# Altium project CUBE_SENSOR.PrjPcb
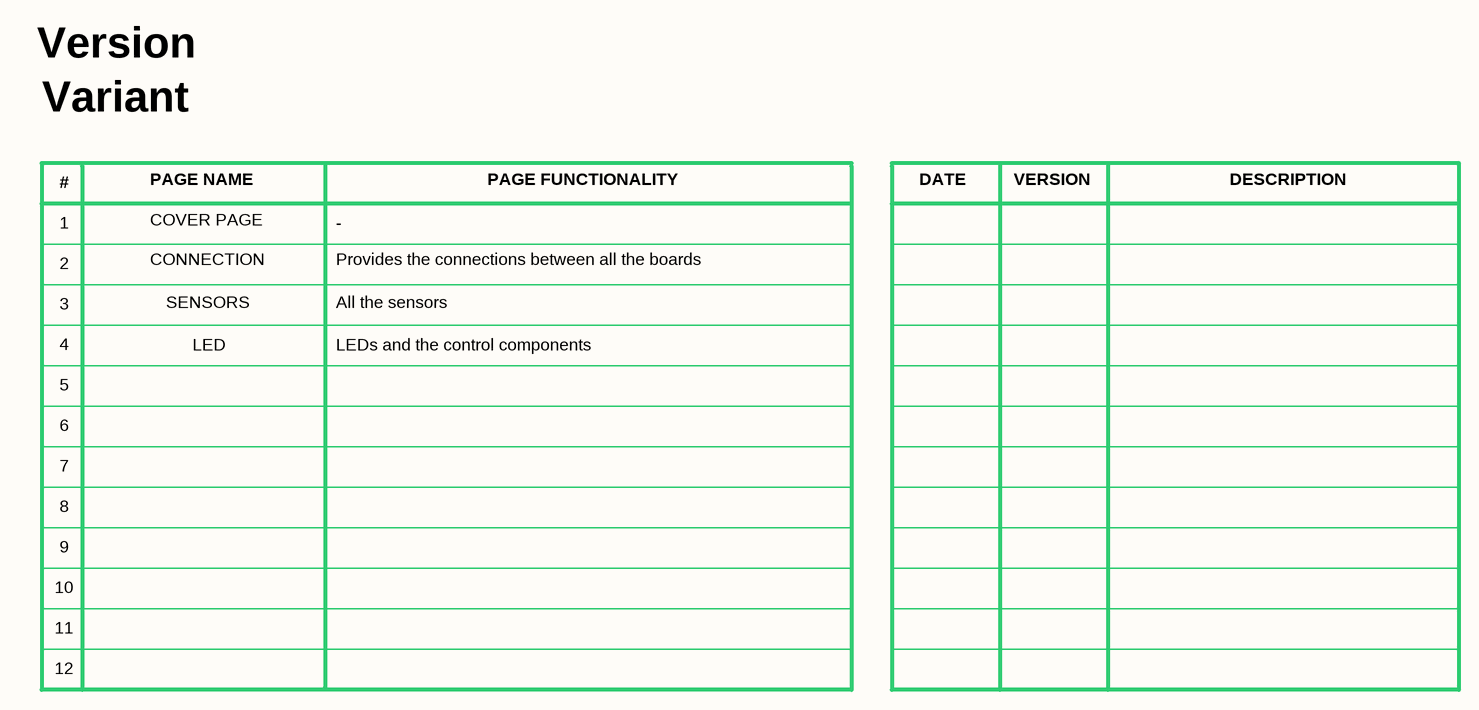
[diagram p0: 01 COVER PAGE.SchDoc]
Global_version: v1.0
4 sheets, 26 parts. Net scope: flat (ports and power ports of the same name join across sheets).
Board file: PCB.PcbDoc
Sheets:
  01 COVER PAGE.SchDoc
  02 CONNECTION.SchDoc
  03 SENSORS.SchDoc
  04 LED.SchDoc

## Sheet 01 COVER PAGE.SchDoc
size 420 x 297 mm

### Notes on the sheet
- Version
- Variant
- #
- PAGE NAME
- PAGE FUNCTIONALITY
- DATE
- VERSION
- DESCRIPTION
- 1
- 2
- CONNECTION
- COVER PAGE
- Provides the connections between all the boards
- -
- 3
- 4
- SENSORS
- All the sensors
- 5
- LED
- LEDs and the control components
- 6
- 7
- 8
- 9
- 10
- 11
- 12
- Title
- Project
- Size
- Date
- Revision
- A3

## Sheet 02 CONNECTION.SchDoc
size 420 x 297 mm
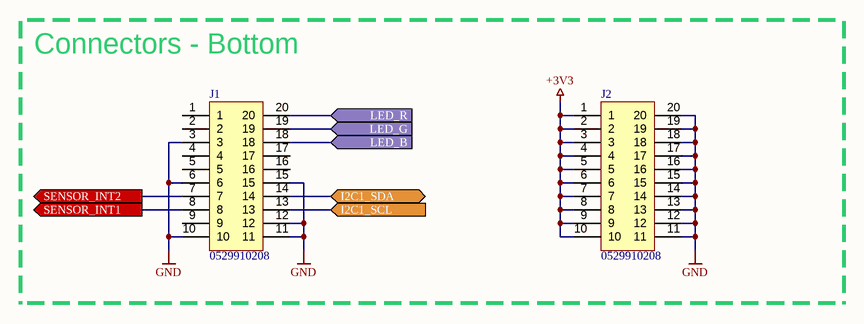
[diagram p1: 02 CONNECTION.SchDoc]

### Parts
J1  0529910208  [0529910208]
J2  0529910208  [0529910208]

### Ports
I2C1_SCL (in), I2C1_SDA (bidir), LED_B (in), LED_G (in), LED_R (in), SENSOR_INT1 (out), SENSOR_INT2 (out)

### Nets
+3V3: J2.1 J2.2 J2.3 J2.4 J2.5 J2.6 J2.7 J2.8 J2.9 J2.10
GND: J1.3 J1.6 J1.10 J1.11 J1.12 J1.15 J2.11 J2.12 J2.13 J2.14 J2.15 J2.16 J2.17 J2.18 J2.19 J2.20
NetJ1_7: J1.7 ; port SENSOR_INT2
NetJ1_8: J1.8 ; port SENSOR_INT1
NetJ1_13: J1.13 ; port I2C1_SCL
NetJ1_14: J1.14 ; port I2C1_SDA
NetJ1_18: J1.18 ; port LED_B
NetJ1_19: J1.19 ; port LED_G
NetJ1_20: J1.20 ; port LED_R

Not connected (* = marked no-connect by the designer): J1 1 2 4 5 9 16 17

### Notes on the sheet
- Connectors - Bottom
- Title
- Project
- Size
- Date
- Revision
- A3

### Library data of the parts
J1 J2 = 0529910208: CONN PLUG 20POS SMD GOLD; manufacturer: MOLEX; mfr_part_number: 0529910208; datasheet: https://www.molex.com/pdm_docs/sd/529910208_sd.pdf

## Sheet 03 SENSORS.SchDoc
size 420 x 297 mm
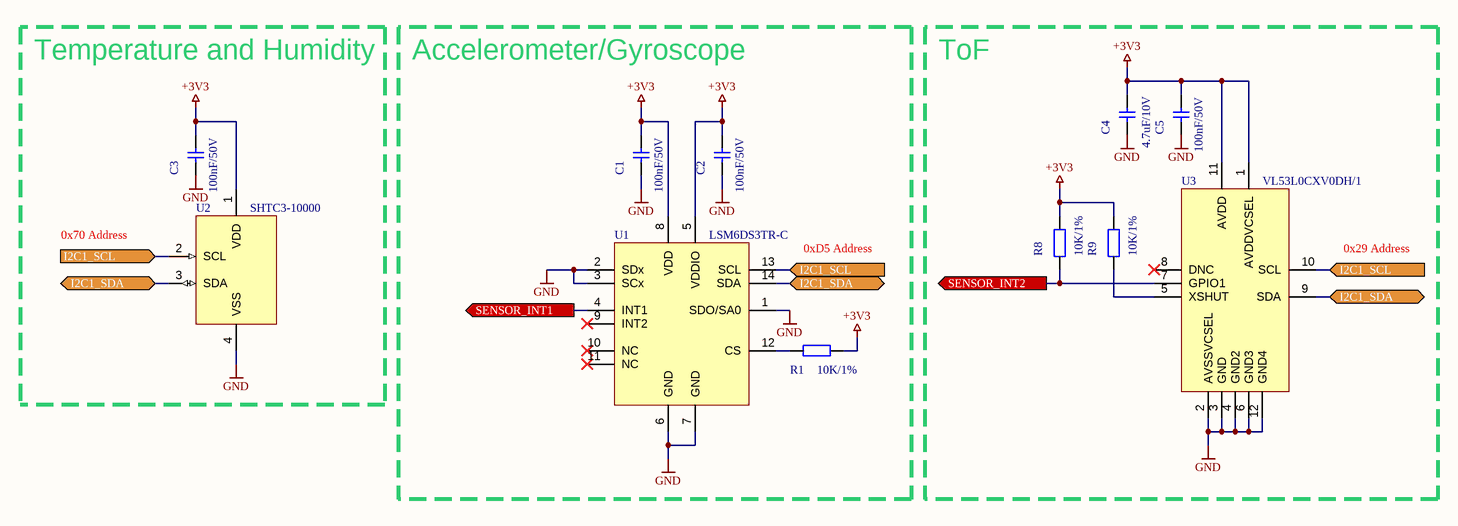
[diagram p2: 03 SENSORS.SchDoc]

### Parts
C1  100nF/50V  [CAPC1005X06N]
C2  100nF/50V  [CAPC1005X06N]
C3  100nF/50V  [CAPC1005X06N]
C4  4.7uF/10V  [CAPC1005X06N]
C5  100nF/50V  [CAPC1005X06N]
R1  10K/1%  [RESC1005X04N]
R8  10K/1%  [RESC1005X04N]
R9  10K/1%  [RESC1005X04N]
U1  LSM6DS3TR-C  [PQFN50P300X250X86-14N]
U2  SHTC3-10000  [SON100P200X75_HS-5N]
U3  VL53L0CXV0DH/1  [VL53L0CXV0DH/1]

### Blocks framed on the sheet
Temperature and Humidity: C3 U2
Accelerometer/Gyroscope: C1 C2 R1 U1
ToF: C4 C5 R8 R9 U3

### Ports
I2C1_SCL (in), I2C1_SDA (bidir), SENSOR_INT1 (out), SENSOR_INT2 (out)

### Nets
+3V3: C1.2 C2.2 C3.2 C4.2 C5.2 R1.1 R8.1 R9.1 U1.5(VDDIO) U1.8(VDD) U2.1(VDD) U3.1(AVDDVCSEL) U3.11(AVDD)
GND: C1.1 C2.1 C3.1 C4.1 C5.1 U1.1(SDO/SA0) U1.2(SDx) U1.3(SCx) U1.6(GND) U1.7(GND) U2.4(VSS) U3.2(AVSSVCSEL) U3.3(GND) U3.4(GND2) U3.6(GND3) U3.12(GND4)
NetJ1_7: R8.2 U3.7(GPIO1) ; port SENSOR_INT2
NetJ1_8: U1.4(INT1) ; port SENSOR_INT1
NetJ1_13: U1.13(SCL) U2.2(SCL) U3.10(SCL) ; port I2C1_SCL
NetJ1_14: U1.14(SDA) U2.3(SDA) U3.9(SDA) ; port I2C1_SDA
NetR1_2: R1.2 U1.12(CS)
NetR9_2: R9.2 U3.5(XSHUT)

Not connected (* = marked no-connect by the designer): U1 9(INT2)* 10(NC)* 11(NC)*; U3 8(DNC)*

### Notes on the sheet
- 0x70 Address
- 0xD5 Address
- 0x29 Address
- Title
- Project
- Size
- Date
- Revision
- A3

### Library data of the parts
C1-C3 C5 = CL05B104KO5NNNC: 16V 100nF X7R ±10% 0402  Multilayer Ceramic Capacitors MLCC - SMD/SMT ROHS; manufacturer: Samsung Electro-Mechanics; assembler_number: C1525; mfr_part_number: CL05B104KO5NNNC; datasheet: https://datasheet.lcsc.com/lcsc/1810191219_Samsung-Electro-Mechanics-CL05B104KO5NNNC_C1525.pdf
C4 = CL05A475MP5NRNC: 10V 4.7uF X5R ±20% 0402  Multilayer Ceramic Capacitors MLCC - SMD/SMT ROHS; manufacturer: Samsung Electro-Mechanics; assembler_number: C23733; mfr_part_number: CL05A475MP5NRNC; datasheet: https://datasheet.lcsc.com/lcsc/1810191211_Samsung-Electro-Mechanics-CL05A475MP5NRNC_C23733.pdf
R1 R8 R9 = 0402WGF1002TCE: 62.5mW Thick Film Resistors 50V ±100ppm/℃ ±1% -55℃~+155℃ 10kΩ 0402  Chip Resistor - Surface Mount ROHS; manufacturer: UNI-ROYAL(Uniroyal Elec); assembler_number: C25744; mfr_part_number: 0402WGF1002TCE; datasheet: https://datasheet.lcsc.com/lcsc/2206010100_UNI-ROYAL-Uniroyal-Elec-0402WGF1002TCE_C25744.pdf
U1 = LSM6DS3TR-C: LGA-14L  Attitude Sensor/Gyroscope ROHS; manufacturer: STMicroelectronics; assembler_number: C967633; mfr_part_number: LSM6DS3TR-C; datasheet: https://datasheet.lcsc.com/lcsc/2102261805_STMicroelectronics-LSM6DS3TR-C_C967633.pdf
U2 = SHTC3-10000: DFN  Temperature and Humidity Sensor ROHS; manufacturer: Sensirion; assembler_number: C2880044; mfr_part_number: SHTC3-10000; datasheet: https://datasheet.lcsc.com/lcsc/2108150430_Sensirion-SHTC3-10000_C2880044.pdf
U3 = VL53L0CXV0DH/1: 4.4*2.4*1.0mm  Position Sensor ROHS; manufacturer: STMicroelectronics; assembler_number: C91199; mfr_part_number: VL53L0CXV0DH/1; datasheet: https://datasheet.lcsc.com/lcsc/1811101103_STMicroelectronics-VL53L0CXV0DH-1_C91199.pdf

## Sheet 04 LED.SchDoc
size 420 x 297 mm
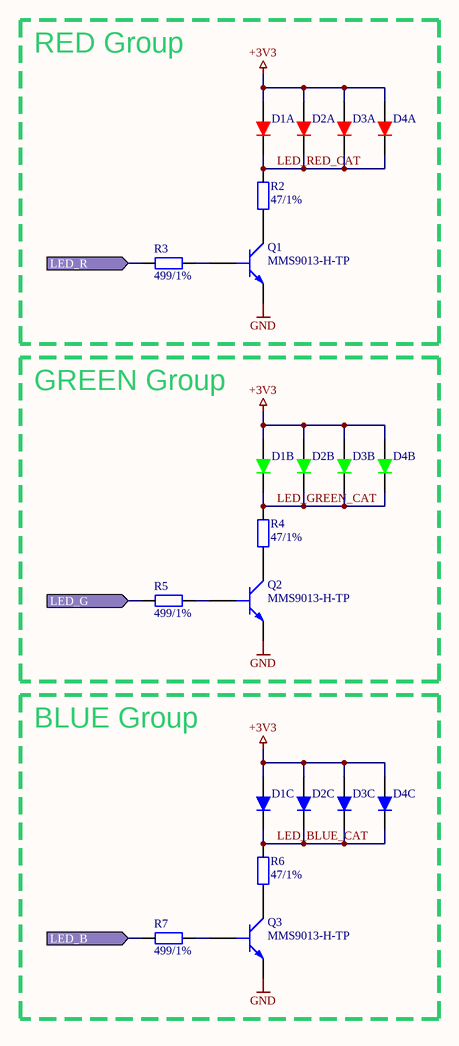
[diagram p3: 04 LED.SchDoc]

### Parts
D1  NH-B2020RGBA-HF  [NH-B2020RGBA-HF]  (value not drawn)  (parts A,B,C of 3)
D2  NH-B2020RGBA-HF  [NH-B2020RGBA-HF]  (value not drawn)  (parts A,B,C of 3)
D3  NH-B2020RGBA-HF  [NH-B2020RGBA-HF]  (value not drawn)  (parts A,B,C of 3)
D4  NH-B2020RGBA-HF  [NH-B2020RGBA-HF]  (value not drawn)  (parts A,B,C of 3)
Q1  MMS9013-H-TP  [SOT95P237X110-3N]
Q2  MMS9013-H-TP  [SOT95P237X110-3N]
Q3  MMS9013-H-TP  [SOT95P237X110-3N]
R2  47/1%  [RESC1005X04N]
R3  499/1%  [RESC1005X04N]
R4  47/1%  [RESC1005X04N]
R5  499/1%  [RESC1005X04N]
R6  47/1%  [RESC1005X04N]
R7  499/1%  [RESC1005X04N]

### Blocks framed on the sheet
RED Group: D1-D4 Q1 R2 R3
GREEN Group: D1-D4 Q2 R4 R5
BLUE Group: D1-D4 Q3 R6 R7

### Ports
LED_B (in), LED_G (in), LED_R (in)

### Nets
+3V3: D1.3 D2.3 D3.3 D4.3
GND: Q1.2 Q2.2 Q3.2
LED_BLUE_CAT: D1.2 D2.2 D3.2 D4.2 R6.2
LED_GREEN_CAT: D1.4 D2.4 D3.4 D4.4 R4.2
LED_RED_CAT: D1.1 D2.1 D3.1 D4.1 R2.2
NetJ1_18: R7.2 ; port LED_B
NetJ1_19: R5.2 ; port LED_G
NetJ1_20: R3.2 ; port LED_R
NetQ1_1: Q1.1 R3.1
NetQ1_3: Q1.3 R2.1
NetQ2_1: Q2.1 R5.1
NetQ2_3: Q2.3 R4.1
NetQ3_1: Q3.1 R7.1
NetQ3_3: Q3.3 R6.1

### Notes on the sheet
- Title
- Project
- Size
- Date
- Revision
- A3

### Library data of the parts
D1-D4 = NH-B2020RGBA-HF: -30℃~+85℃ Common anode RGB 110° SMD,2.1x2.1mm  Light Emitting Diodes (LED) ROHS; manufacturer: Foshan NationStar Optoelectronics; assembler_number: C2874116; mfr_part_number: NH-B2020RGBA-HF; datasheet: https://datasheet.lcsc.com/lcsc/2108150330_Foshan-NationStar-Optoelectronics-NH-B2020RGBA-HF_C2874116.pdf
Q1-Q3 = MMS9013-H-TP: manufacturer: MCC(Micro Commercial Components); assembler_number: C90160; mfr_part_number: MMS9013-H-TP; datasheet: https://datasheet.lcsc.com/lcsc/1912112237_MCC-Micro-Commercial-Components-MMS9013-H-TP_C90160.pdf
R2 R4 R6 = RCT0247RJLF: 62.5mW ±5% 47Ω 0402  Chip Resistor - Surface Mount ROHS; manufacturer: HKR(Hong Kong Resistors); assembler_number: C174246; mfr_part_number: RCT0247RJLF; datasheet: https://datasheet.lcsc.com/lcsc/1810251713_HKR-Hong-Kong-Resistors-RCT0247RJLF_C174246.pdf
R3 R5 R7 = RC0402FR-07499RL: 62.5mW Thick Film Resistors 50V ±100ppm/℃ ±1% -55℃~+155℃ 499Ω 0402  Chip Resistor - Surface Mount ROHS; manufacturer: YAGEO; assembler_number: C137970; mfr_part_number: RC0402FR-07499RL; datasheet: https://datasheet.lcsc.com/lcsc/1810241332_YAGEO-RC0402FR-07499RL_C137970.pdf

## Nets that join several sheets
+3V3: 02 CONNECTION (10 pins), 03 SENSORS (13 pins), 04 LED (D1.3 D2.3 D3.3 D4.3)
GND: 02 CONNECTION (16 pins), 03 SENSORS (16 pins), 04 LED (Q1.2 Q2.2 Q3.2)
NetJ1_7: 02 CONNECTION (J1.7), 03 SENSORS (R8.2 U3.7)
NetJ1_8: 02 CONNECTION (J1.8), 03 SENSORS (U1.4)
NetJ1_13: 02 CONNECTION (J1.13), 03 SENSORS (U1.13 U2.2 U3.10)
NetJ1_14: 02 CONNECTION (J1.14), 03 SENSORS (U1.14 U2.3 U3.9)
NetJ1_18: 02 CONNECTION (J1.18), 04 LED (R7.2)
NetJ1_19: 02 CONNECTION (J1.19), 04 LED (R5.2)
NetJ1_20: 02 CONNECTION (J1.20), 04 LED (R3.2)